# EAGLE schematic 00A-83 (EAGLE 6.3)
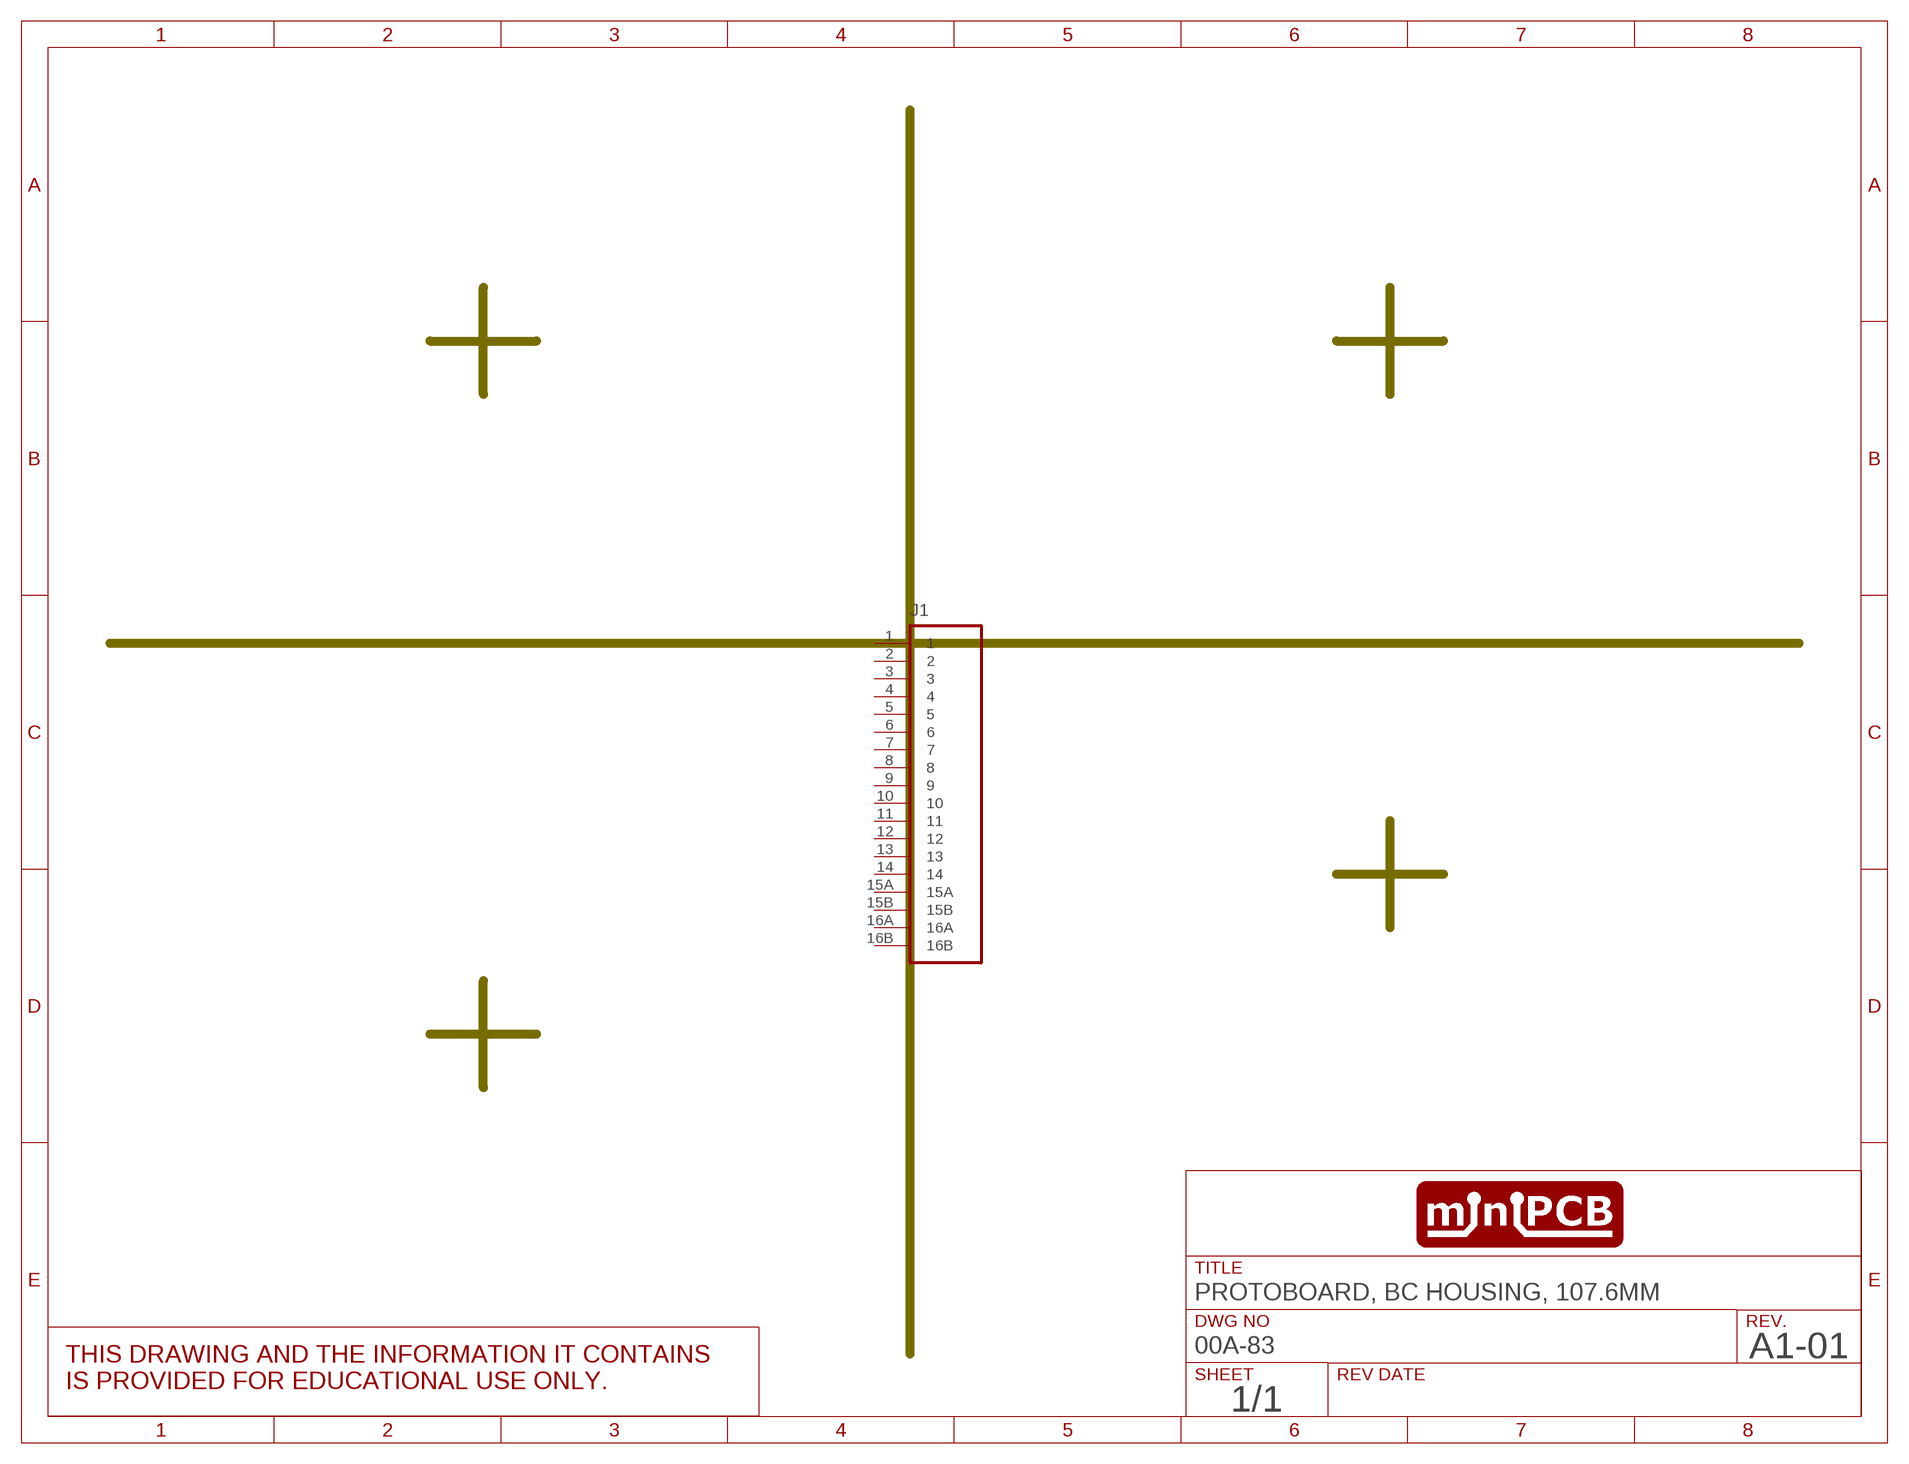
[diagram p0: schematic, sheet 1]
SHEET1 (SCHEMATIC): DWG_NO: 00A-83; REV: A1-01; TITLE: PROTOBOARD, BC HOUSING, 107.6MM

## Parts
J1  BC_HOUSING_107.6MM  [BC_HOUSING_107MM]
Unconnected: J1.1 J1.2 J1.3 J1.4 J1.5 J1.6 J1.7 J1.8 J1.9 J1.10 J1.11 J1.12 J1.13 J1.14 J1.15A J1.15B J1.16A J1.16B

## Library data of the parts
J1 = miniPCB_BOARDS:BC_HOUSING